# Altium schematic sheet Top.SchDoc
size A
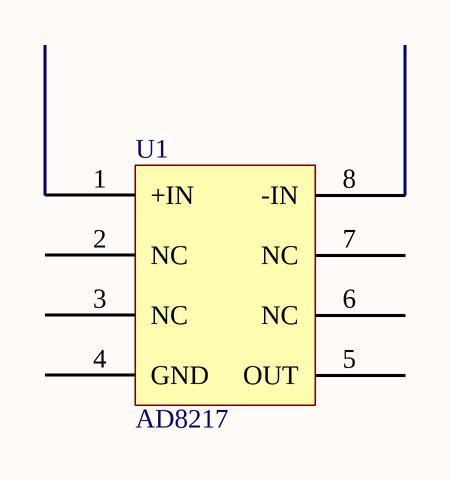
[diagram p0: Top.SchDoc]

## Parts
U1  AD8217  [AD8217_DT]

## Nets

Not connected (* = marked no-connect by the designer): U1 1(+IN) 2(NC) 3(NC) 4(GND) 5(OUT) 6(NC) 7(NC) 8(-IN)

## Library data of the parts
U1 = Component_1